# EAGLE design board (EAGLE 9.6.2)
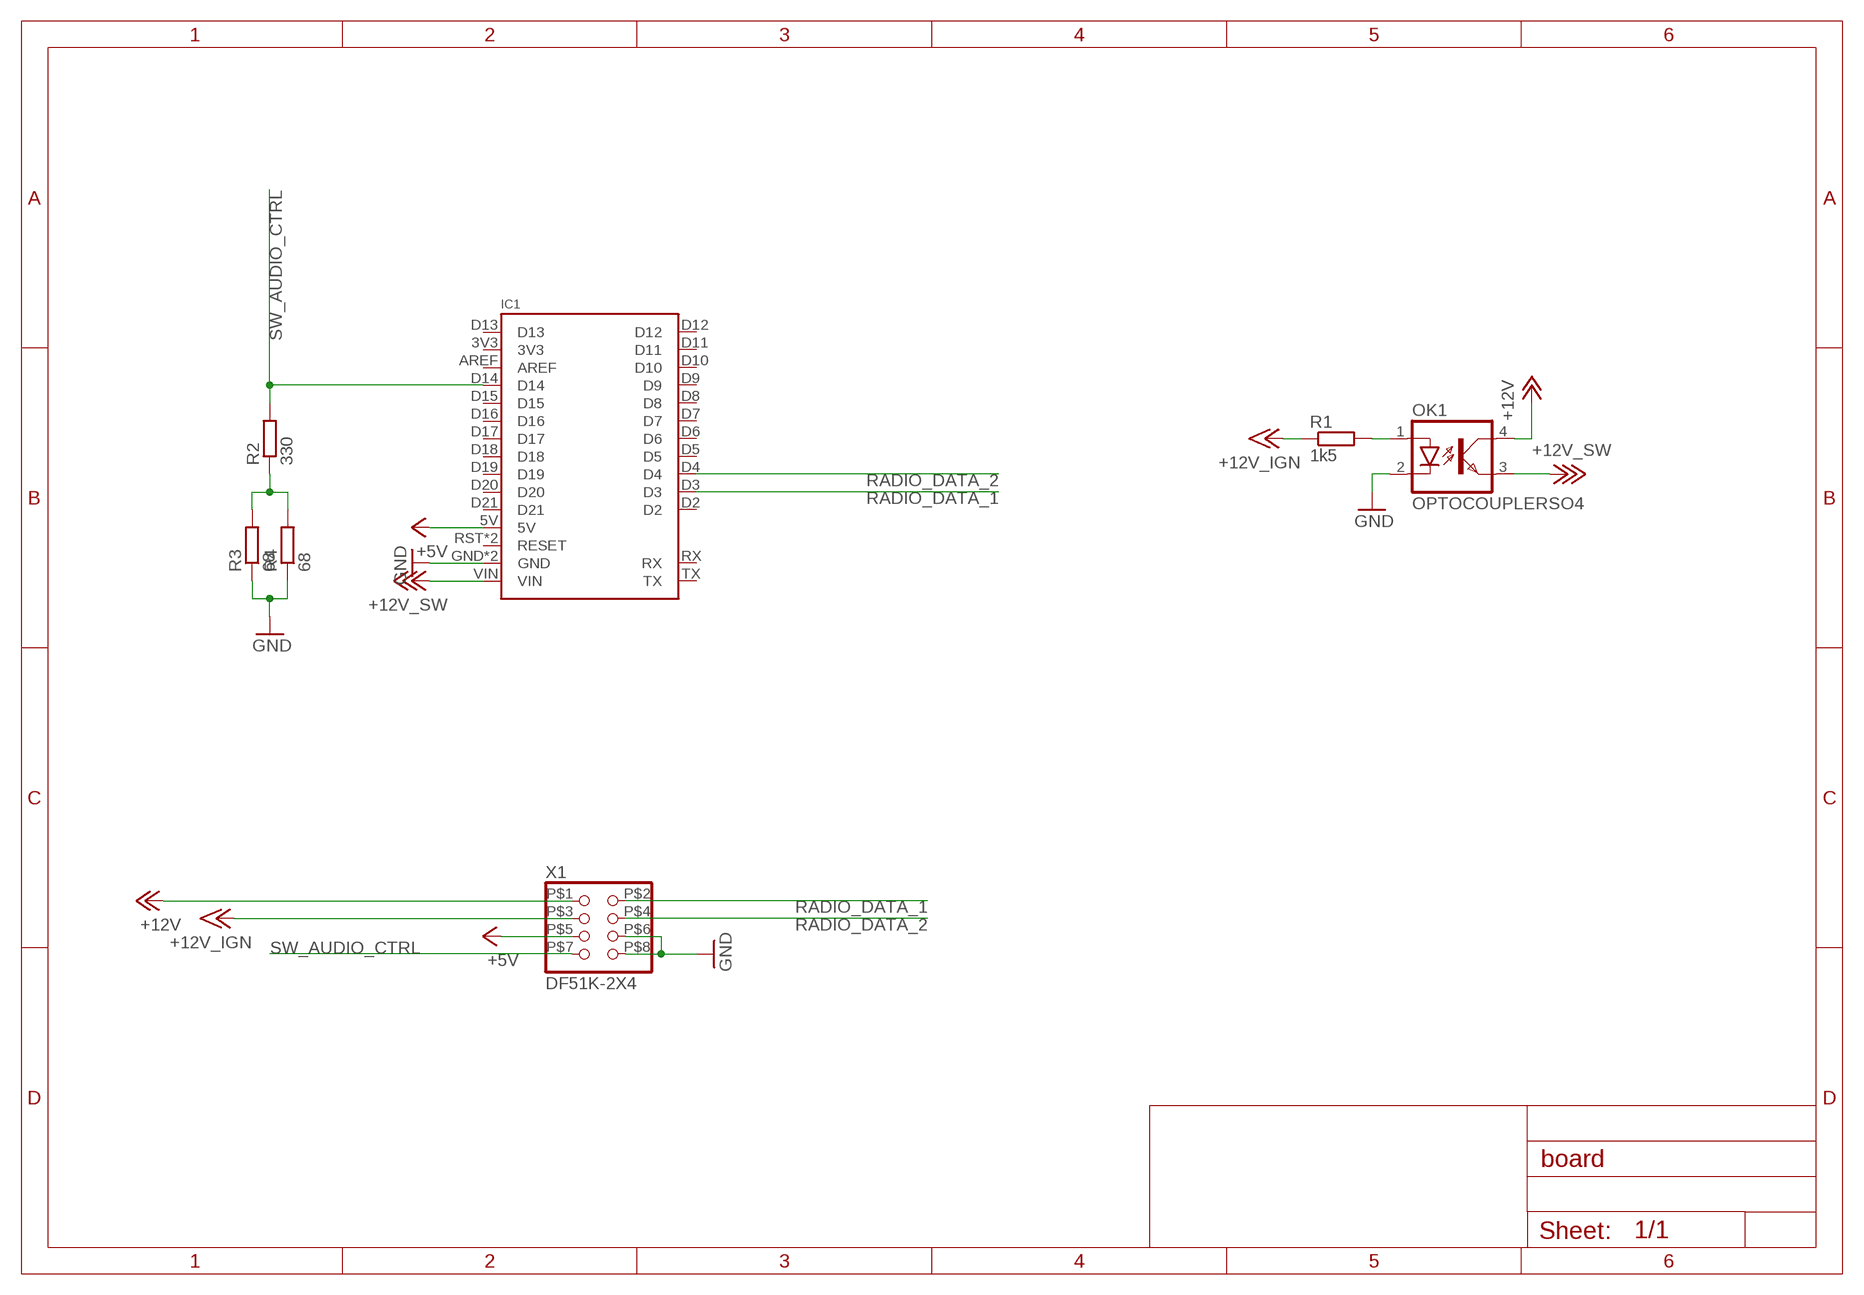
[diagram p0: schematic, sheet 1]

## Parts
IC1  ARDUINO_NANO_EVERY  [ARDUINO_NANO_EVERY]
OK1  OPTOCOUPLERSO4  [SO04]
R1  1k5  RESISTOR0805  [R0805]
R2  330  RESISTOR0805  [R0805]
R3  68  RESISTOR0805  [R0805]
R4  68  RESISTOR0805  [R0805]
X1  DF51K-2X4  [DF51K-2X4]

## Nets
+5V: IC1.5V X1.P$5
+12V: OK1.4(COL) X1.P$1
+15V: R1.1 X1.P$3 ; supply symbol labelled +12V_IGN
+18V: IC1.VIN OK1.3(EMIT) ; supply symbol labelled +12V_SW
GND: IC1.GND IC1.GND2(GND) OK1.2(C) R3.1 R4.1 X1.P$6 X1.P$8
N$1: OK1.1(A) R1.2
N$2: R2.1 R3.2 R4.2
RADIO_DATA_1: IC1.D3 X1.P$2
RADIO_DATA_2: IC1.D4 X1.P$4
SW_AUDIO_CTRL: IC1.D14 R2.2 X1.P$7
Unconnected: IC1.3V3 IC1.AREF IC1.D2 IC1.D5 IC1.D6 IC1.D7 IC1.D8 IC1.D9 IC1.D10 IC1.D11 IC1.D12 IC1.D13 IC1.D15 IC1.D16 IC1.D17 IC1.D18 IC1.D19 IC1.D20 IC1.D21 IC1.RST2(RESET) IC1.RST(RESET) IC1.RX IC1.TX

## Library data of the parts
IC1 = SMD:ARDUINO_NANO_EVERY
OK1 = SMD:OPTOCOUPLER
R1-R4 = SMD:RESISTOR
X1 = THT:DF51K-2X4

## Board
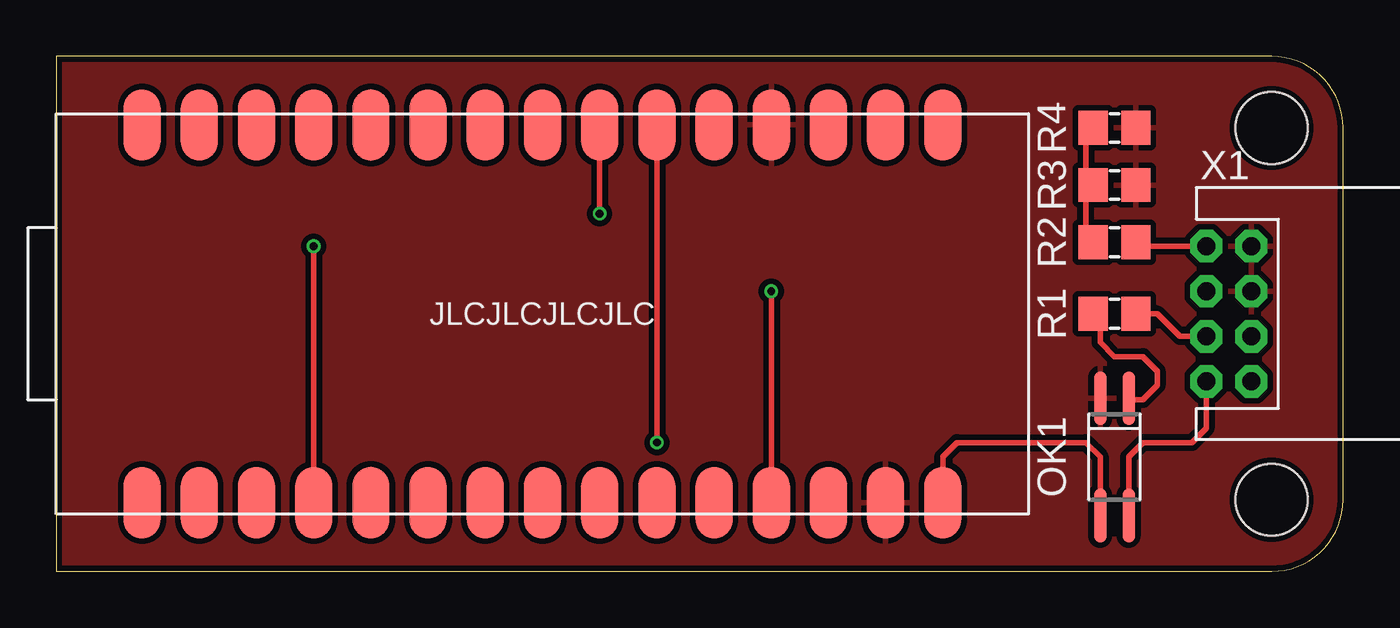
[diagram p1: board, top side]
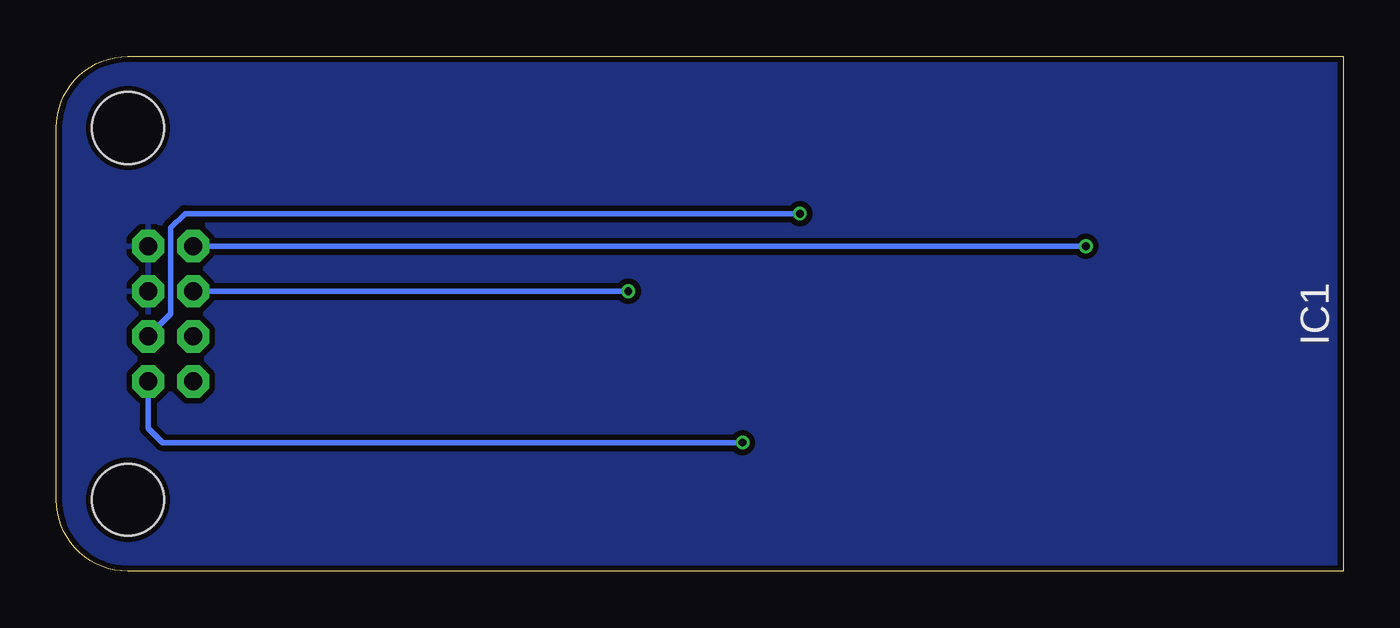
[diagram p2: board, bottom side, seen from below]

Size 57.15 x 22.86 mm. Coordinates in mm from the lower left corner, seen from the top.
Outline: 0,0 53.98,0 arc90 57.15,3.17 57.15,19.68 arc90 53.98,22.86 0,22.86 0,0
Copper layers (1*16): Top 0.035mm / dielectric 1.6mm / Bottom 0.035mm
Design rules "jlc-pcb *": minimum track width 6mil, minimum drill 0.3mm, track to track 6mil, track to pad 6mil, pad to pad 6mil, via to via 6mil, smd to smd 6mil, copper to edge 0.2mm, drill to drill 6mil, minimum pad ring 10mil, minimum via ring 5mil, stop-mask expansion 4mil, vias tented up to drill 20mil, thermal gap 10mil
Holes 3.2 mm at 53.98,19.68 53.98,3.17

### Footprints (pad centres in the part's own frame; a part is rotated, then mirrored left to right if it is on the bottom)
ARDUINO_NANO_EVERY = smd 1.651 x 3.175: 3V3 -15.24,-8.382; 5V 10.16,-8.382; AREF -12.7,-8.382; D2 7.62,8.382; D3 5.08,8.382; D4 2.54,8.382; D5 0,8.382; D6 -2.54,8.382; D7 -5.08,8.382; D8 -7.62,8.382; D9 -10.16,8.382; D10 -12.7,8.382; D11 -15.24,8.382; D12 -17.78,8.382; D13 -17.78,-8.382; D14 -10.16,-8.382; D15 -7.62,-8.382; D16 -5.08,-8.382; D17 -2.54,-8.382; D18 0,-8.382; D19 2.54,-8.382; D20 5.08,-8.382; D21 7.62,-8.382; GND 10.16,8.382; GND2 15.24,-8.382; RST 12.7,8.382; RST2 12.7,-8.382; RX 15.24,8.382; TX 17.78,8.382; VIN 17.78,-8.382
SO04 = smd 0.559 x 2.388: 1 -0.635,-2.6; 2 0.635,-2.6; 3 0.635,2.6; 4 -0.635,2.6
R0805 = smd 1.3 x 1.5: 1 -0.95,0; 2 0.95,0
DF51K-2X4 = drill 0.8 octagon: P$1 -3,1; P$2 -3,-1; P$3 -1,1; P$4 -1,-1; P$5 1,1; P$6 1,-1; P$7 3,1; P$8 3,-1

### Placement (x,y rotation side)
IC1  21.59,11.43 0 top
OK1  46.99,5.08 180 top
R1  46.99,11.43 180 top
R2  46.99,14.61 0 top
R3  46.99,17.14 180 top
R4  46.99,19.68 180 top
X1  52.07,11.43 90 top

### Tracks (layer width: path | path; a pad name or v marks a point on that pad's centre or on a via)
+5V  (via drill 0.35)
  Top 0.254: v31.75,12.43 IC1.5V
  Bottom 0.254: X1.P$5 v31.75,12.43
+12V
  Top 0.254: OK1.4 47.62,5.08 48.26,5.71 50.44,5.71 51.07,6.35 X1.P$1
+15V
  Top 0.254: X1.P$3 49.9,10.43 48.9,11.43 R1.1
+18V
  Top 0.254: IC1.VIN 39.37,5.08 40.01,5.71 45.72,5.71 46.35,5.08 OK1.3
GND
  pour Top (isolate 0.254): 0,22.86 53.98,22.86 arc-90 57.15,19.68 57.15,3.17 arc-90 53.98,0 0,0
  pour Bottom (isolate 0.254): 0,22.86 53.98,22.86 arc-90 57.15,19.68 57.15,3.17 arc-90 53.98,0 0,0
N$1
  Top 0.254: R1.2 46.04,11.11 46.35,10.79 46.35,10.16 46.99,9.53 48.26,9.53 48.9,8.89 48.9,8.26 48.26,7.62 47.69,7.62 OK1.1
N$2
  Top 0.254: R4.2 45.72,19.68 45.72,17.46 45.88,17.3 | 45.88,17.3 R3.2 | R2.1 45.72,14.93 45.72,17.14 45.88,17.3
RADIO_DATA_1  (via drill 0.35)
  Top 0.254: IC1.D3 v26.67,5.71
  Bottom 0.254: X1.P$2 53.07,6.35 52.44,5.71 v26.67,5.71
RADIO_DATA_2  (via drill 0.35)
  Top 0.254: IC1.D4 v24.13,15.88
  Bottom 0.254: X1.P$4 52.07,11.43 52.07,15.24 51.44,15.88 v24.13,15.88
SW_AUDIO_CTRL  (via drill 0.35)
  Top 0.254: X1.P$7 48.12,14.43 R2.2 | v11.43,14.43 IC1.D14
  Bottom 0.254: X1.P$7 v11.43,14.43

### Text on the board
tNames: JLCJLCJLCJLC